# Altium schematic sheet EthIO_Gateway.SchDoc
size A4; SheetNumber: 1; SheetTotal: 7
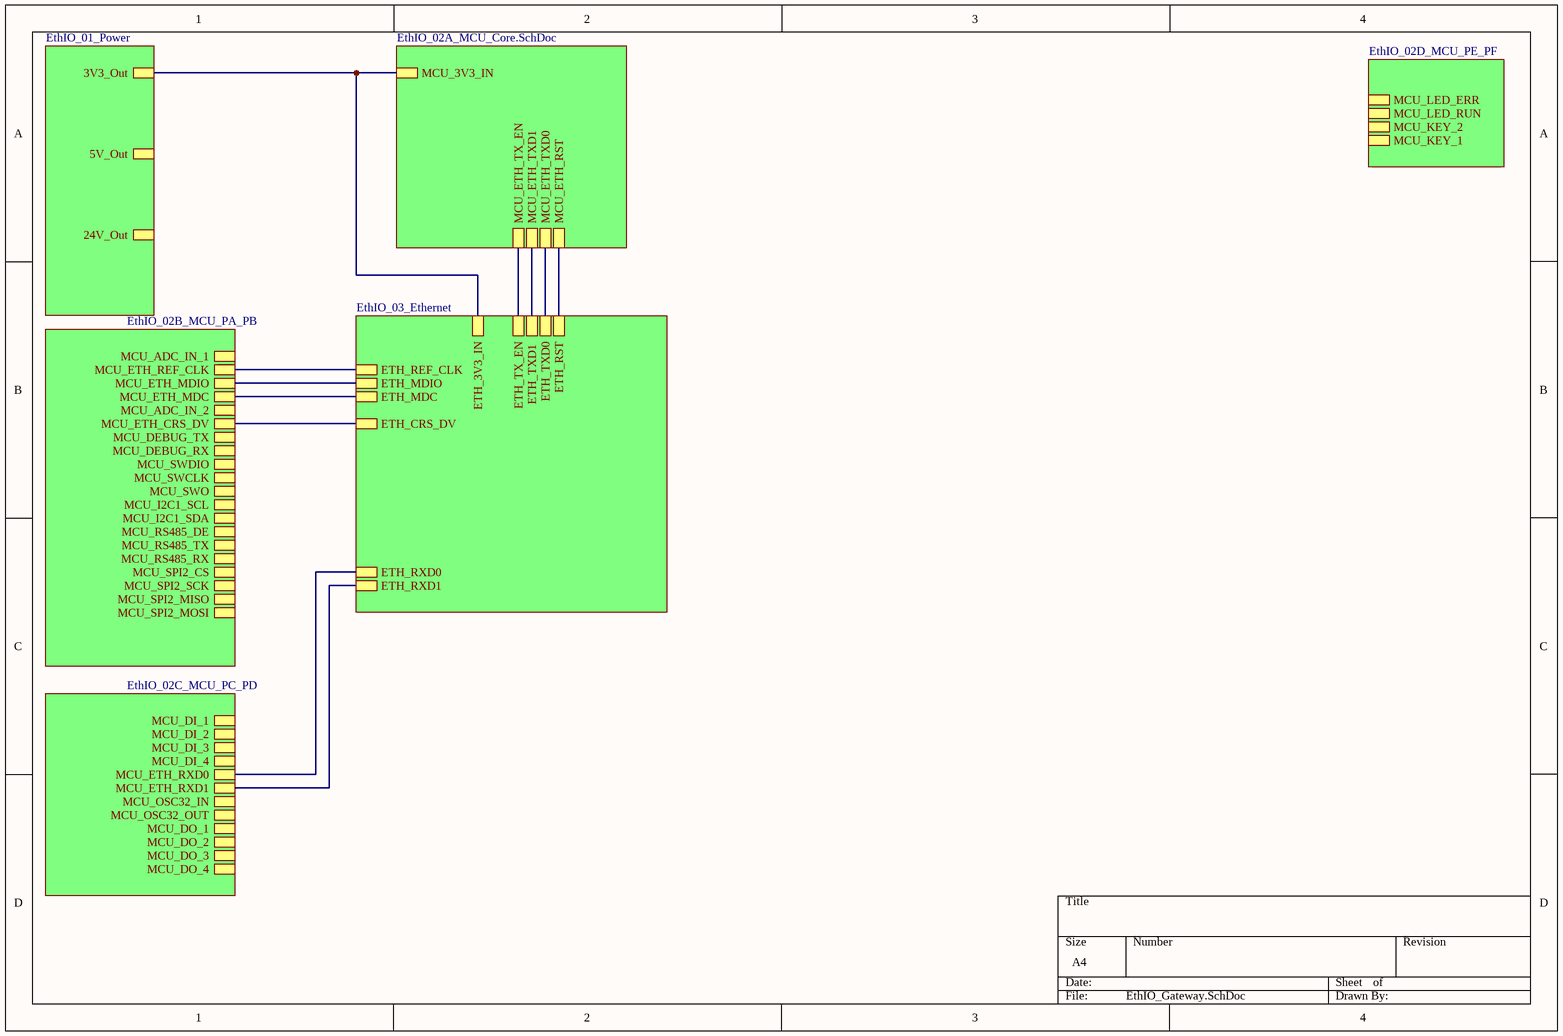
[diagram p0: EthIO_Gateway.SchDoc]

## Sub-sheets
EthIO_01_Power = EthIO_01_Power: 3V3_Out, 5V_Out, 24V_Out
EthIO_02A_MCU_Core.SchDoc = EthIO_02A_MCU_Core.SchDoc: MCU_3V3_IN, MCU_ETH_TX_EN, MCU_ETH_TXD0, MCU_ETH_TXD1, MCU_ETH_RST
EthIO_02B_MCU_PA_PB = EthIO_02B_MCU_PA_PB: MCU_ADC_IN_1, MCU_ETH_REF_CLK, MCU_ETH_MDIO, MCU_ETH_MDC, MCU_ADC_IN_2, MCU_ETH_CRS_DV, MCU_DEBUG_TX, MCU_DEBUG_RX, MCU_SWDIO, MCU_SWCLK, MCU_SWO, MCU_I2C1_SCL, MCU_I2C1_SDA, MCU_RS485_DE, MCU_RS485_TX, MCU_RS485_RX, MCU_SPI2_CS, MCU_SPI2_SCK, MCU_SPI2_MISO, MCU_SPI2_MOSI
EthIO_02C_MCU_PC_PD = EthIO_02C_MCU_PC_PD: MCU_DI_1, MCU_DI_2, MCU_DI_3, MCU_DI_4, MCU_ETH_RXD0, MCU_ETH_RXD1, MCU_OSC32_IN, MCU_OSC32_OUT, MCU_DO_1, MCU_DO_2, MCU_DO_3, MCU_DO_4
EthIO_02D_MCU_PE_PF = EthIO_02D_MCU_PE_PF: MCU_KEY_1, MCU_KEY_2, MCU_LED_RUN, MCU_LED_ERR
EthIO_03_Ethernet = EthIO_03_Ethernet: ETH_TXD0, ETH_TXD1 , ETH_TX_EN, ETH_REF_CLK, ETH_MDC, ETH_CRS_DV, ETH_RXD1, ETH_MDIO, ETH_RXD0, ETH_RST, ETH_3V3_IN

## Nets
(unnamed): sheet EthIO_01_Power/3V3_Out, sheet EthIO_02A_MCU_Core.SchDoc/MCU_3V3_IN, sheet EthIO_03_Ethernet/ETH_3V3_IN
(unnamed): sheet EthIO_02A_MCU_Core.SchDoc/MCU_ETH_TX_EN, sheet EthIO_03_Ethernet/ETH_TX_EN
(unnamed): sheet EthIO_02A_MCU_Core.SchDoc/MCU_ETH_TXD0, sheet EthIO_03_Ethernet/ETH_TXD0
(unnamed): sheet EthIO_02A_MCU_Core.SchDoc/MCU_ETH_TXD1, sheet EthIO_03_Ethernet/ETH_TXD1 
(unnamed): sheet EthIO_02A_MCU_Core.SchDoc/MCU_ETH_RST, sheet EthIO_03_Ethernet/ETH_RST
(unnamed): sheet EthIO_02B_MCU_PA_PB/MCU_ETH_REF_CLK, sheet EthIO_03_Ethernet/ETH_REF_CLK
(unnamed): sheet EthIO_02B_MCU_PA_PB/MCU_ETH_MDIO, sheet EthIO_03_Ethernet/ETH_MDIO
(unnamed): sheet EthIO_02B_MCU_PA_PB/MCU_ETH_MDC, sheet EthIO_03_Ethernet/ETH_MDC
(unnamed): sheet EthIO_02B_MCU_PA_PB/MCU_ETH_CRS_DV, sheet EthIO_03_Ethernet/ETH_CRS_DV
(unnamed): sheet EthIO_02C_MCU_PC_PD/MCU_ETH_RXD0, sheet EthIO_03_Ethernet/ETH_RXD0
(unnamed): sheet EthIO_02C_MCU_PC_PD/MCU_ETH_RXD1, sheet EthIO_03_Ethernet/ETH_RXD1